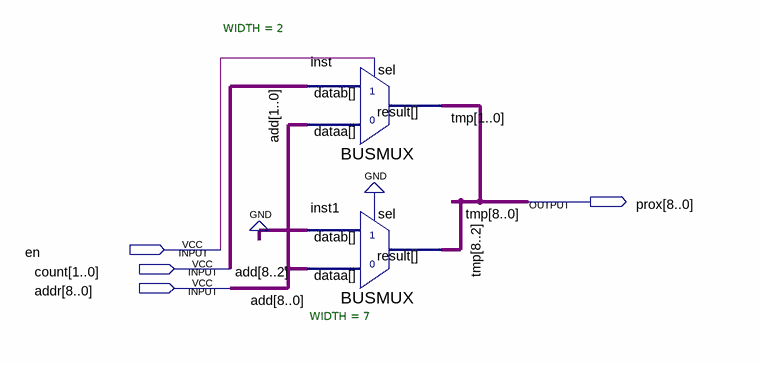
[diagram p0: schematic sheet]
// Quartus schematic Proxy.bdf as structural Verilog: 2 symbols, 4 pins
module Proxy (
  input  en,
  input  [1:0] count,
  input  [8:0] addr,
  output [8:0] prox
);

  BUSMUX #(.WIDTH(2)) inst (.datab(count), .sel(en), .dataa(addr[1:0]), .result(prox[1:0]));
  BUSMUX #(.WIDTH(7)) inst1 (.datab({7{1'b0}}), .sel(1'b0), .dataa(addr[8:2]), .result(prox[8:2]));

  // Other names for the same wires on the sheet: add[8:0] = addr; tmp[8:0] = prox
endmodule
